# EasyEDA schematic smd.json
TITLE: Sheet_1; REV: 1.0; Date: 2025-09-05; Sheet: 1/1; Drawn By: amalanjula1; Company: Your Company
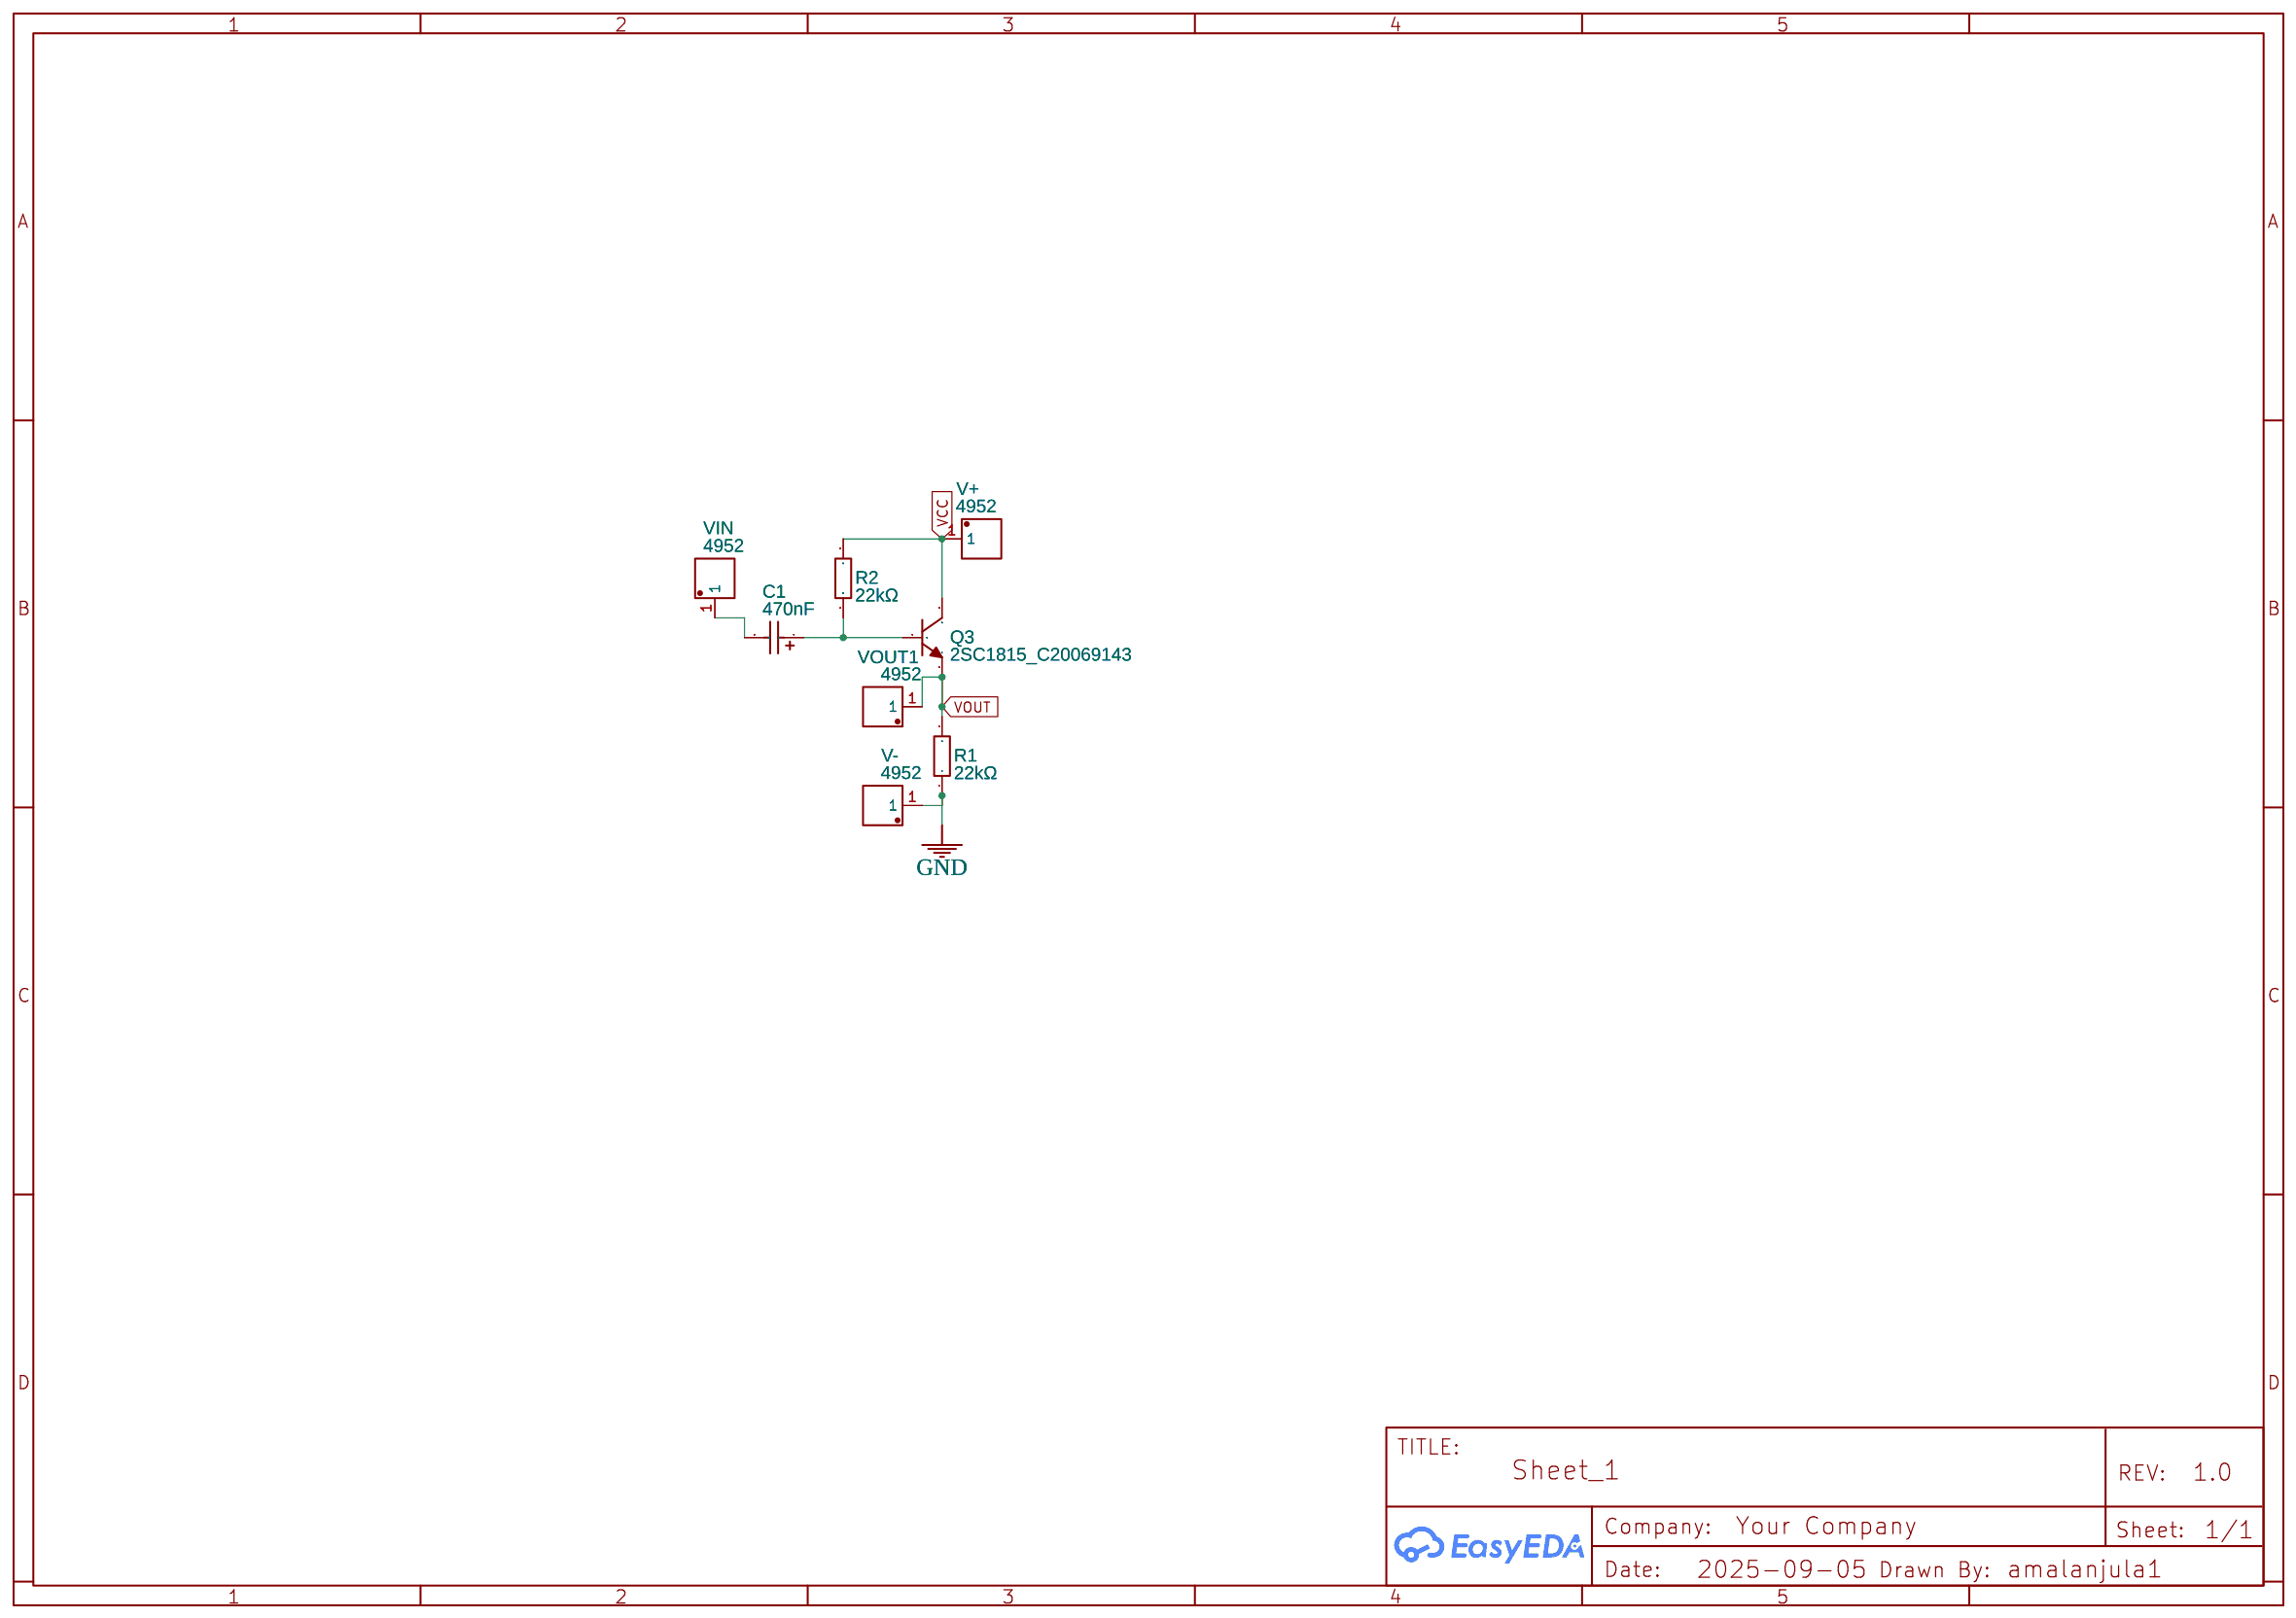
[diagram p0: schematic sheet]

## Parts
C1  470nF  [CAP-SMD_L3.2-W1.6-RD]
Q3  2SC1815_C20069143  [SOT-23-3_L2.9-W1.3-P1.90-LS2.4-BR]
R1  22kΩ  [R0603]
R2  22kΩ  [R0603]
V+  4952  [CONN-TH_L3.0-W1.2]
V-  4952  [CONN-TH_L3.0-W1.2]
VIN  4952  [CONN-TH_L3.0-W1.2]
VOUT1  4952  [CONN-TH_L3.0-W1.2]

## Library data of the parts
C1 = TAJA474K035RNJ: Supplier: LCSC; Manufacturer: Kyocera AVX; Supplier Part: C11368; JLCPCB Part Class: Extended Part
Q3 = 2SC1815_C20069143: Supplier: LCSC; Supplier Part: C20069143; Manufacturer: R+O(宏嘉诚); Manufacturer Part: 2SC1815; JLCPCB Part Class: Extended Part; Contributor: lcsc
R1 R2 = 0603WAF2202T5E: Supplier: LCSC; Manufacturer: UNI-ROYAL(厚声); Supplier Part: C31850; JLCPCB Part Class: Basic Part
V+ V- VIN VOUT1 = 4952: Contributor: LCSC; Supplier: LCSC; Supplier Part: C238118; Manufacturer: Keystone; JLCPCB Part Class: Extended Part

## Nets
GND: R1.1 V-.1
VCC: Q3.3(C) R2.2 V+.1
VOUT: Q3.2(E) R1.2 VOUT1.1
Net-(C1-1): C1.1 Q3.1(B) R2.1
Net-(C1-2): C1.2 VIN.1
